# EAGLE schematic Autonomous_v1 (EAGLE 9.7.0)
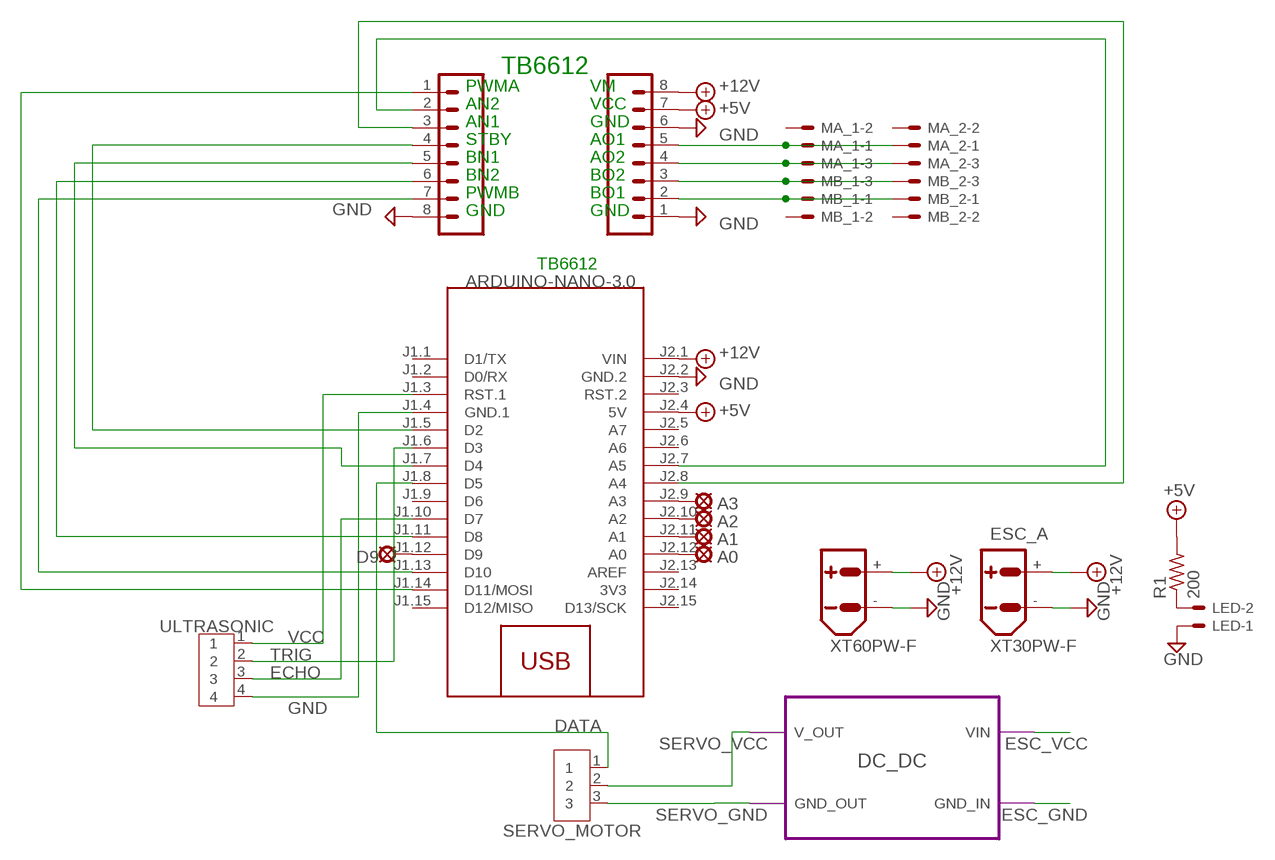
[diagram p0: schematic, sheet 1]

## Parts
A0  LSP10  [LSP10]
A1  LSP10  [LSP10]
A2  LSP10  [LSP10]
A3  LSP10  [LSP10]
BATTERY  XT60PW-F  [XT60PW-F]
D9  LSP10  [LSP10]
ESC_A  XT30PW-F  [XT30PW-F]
J1  CONN_08NO_SILK_FEMALE_PTH  [1X08_NO_SILK]
J2  CONN_08NO_SILK_FEMALE_PTH  [1X08_NO_SILK]
LED  JST-XH-02-PIN-LONG-PAD  [JST-XH-02-PACKAGE-LONG-PAD]
M1  ARDUINO-NANO-3.0  [ARDUINO-NANO-3.0]
MA_1  JST-XH-03-PIN-LONG-PAD  [JST-XH-03-PACKAGE-LONG-PAD]
MA_2  JST-XH-03-PIN-LONG-PAD  [JST-XH-03-PACKAGE-LONG-PAD]
MB_1  JST-XH-03-PIN-LONG-PAD  [JST-XH-03-PACKAGE-LONG-PAD]
MB_2  JST-XH-03-PIN-LONG-PAD  [JST-XH-03-PACKAGE-LONG-PAD]
R1  200  R-US_0204/5  [0204/5]
SERVO_MOTOR  B3P-VH  [B3P-VH_396_3N]
ULTRASONIC  B4B-XH-A  [B4B-XH-A]

## Module instances
DC_DC = DC_DC

## Nets
+5V: J1.7 M1.J2.4(5V) R1.2
+12V: BATTERY.+ ESC_A.+ J1.8 M1.J2.1(VIN)
DATA: M1.J1.8(D5) SERVO_MOTOR.1
ECHO: M1.J1.10(D7) ULTRASONIC.3
ESC_GND: port DC_DC.GND_IN
ESC_VCC: port DC_DC.VIN
GND: BATTERY.- ESC_A.- J1.1 J1.6 J2.8 LED.1 M1.J1.4(GND.1) M1.J2.2(GND.2) ULTRASONIC.4
N$3: D9.MP M1.J1.12(D9)
N$8: J2.4 M1.J1.5(D2)
N$9: J2.3 M1.J2.8(A4)
N$10: J1.5 MA_1.1 MA_2.1
N$11: J1.4 MA_1.3 MA_2.3
N$12: J1.2 MB_1.1 MB_2.1
N$13: J1.3 MB_1.3 MB_2.3
N$15: J2.2 M1.J2.7(A5)
N$16: J2.5 M1.J1.7(D4)
N$17: J2.6 M1.J1.11(D8)
N$18: LED.2 R1.1
N$20: J2.7 M1.J1.13(D10)
N$21: J2.1 M1.J1.14(D11/MOSI)
N$24: A3.MP M1.J2.9(A3)
N$25: A1.MP M1.J2.11(A1)
N$27: A0.MP M1.J2.12(A0)
N$28: A2.MP M1.J2.10(A2)
SERVO_GND: SERVO_MOTOR.3 ; port DC_DC.GND_OUT
SERVO_VCC: SERVO_MOTOR.2 ; port DC_DC.V_OUT
TRIG: M1.J1.6(D3) ULTRASONIC.2
VCC: M1.J1.3(RST.1) ULTRASONIC.1
Unconnected: M1.J1.1(D1/TX) M1.J1.2(D0/RX) M1.J1.9(D6) M1.J1.15(D12/MISO) M1.J2.3(RST.2) M1.J2.5(A7) M1.J2.6(A6) M1.J2.13(AREF) M1.J2.15(D13/SCK) MA_1.2 MA_2.2 MB_1.2 MB_2.2

## Notes on the sheet
- TB6612
- PWMA | VM
- AN2 | VCC
- AN1 | GND
- STBY | AO1
- BN1 | AO2
- BN2 | BO2
- PWMB | BO1
- GND | GND
- TB6612

## Power pins joined to a net without a drawn wire
3V3: M1.J2.14(3V3)

## Library data of the parts
A0 A1-A3 D9 = solpad:LSP10: SOLDER PAD drill 1.0 mm, distributor Buerklin, 12H555
BATTERY = xt30:XT60: AMASS XT60 connector Store in Japan AMASS XT60 connector <https://szc.jp/ams-xt60>
ESC_A = xt30:XT30: AMASS XT30 connector Store in Japan AMASS XT30 connector <https://szc.jp/ams-xt30>
J1 J2 = SparkFun-Connectors:CONN_08: Multi connection point. Often used as Generic Header-pin footprint for 0.1 inch spaced/style header connections On any of the 0.1 inch spaced packages, you can populate with these: Break Away Headers - Straight <https://www.sparkfun.com/products/116> (PRT-00116) Break Away Male Headers - Right Angle <https://www.sparkfun.com/products/553> (PRT-00553) Female Headers <https://www.sparkfun.com/products/115> (PRT-00115) Break Away Headers - Machine Pin <https://www.sparkfun.com/products/117> (PRT-00117) Break Away Female Headers - Swiss Machine Pin <https://www.sparkfun.com/products/743> (PRT-00743) Arduino Stackable Header - 8 Pin <https://www.sparkfun.com/products/9279> (PRT-09279) For SCREWTERMINALS and SPRING TERMINALS visit here: Screw Terimnals on SparkFun.com <https://www.sparkfun.com/search/results?term=Screw+Terminals> (5mm/3.5mm/2.54mm spacing) This device is also useful as a general connection point to wire up your design to another part of your project. Our various solder wires solder well into these plated through hole pads. Hook-Up Wire - Assortment (Stranded, 22 AWG) <https://www.sparkfun.com/products/11375> (PRT-11375) Hook-Up Wire - Assortment (Solid Core, 22 AWG) <https://www.sparkfun.com/products/11367> (PRT-11367) View the entire wire category on our website here <https://www.sparkfun.com/categories/141> Special notes: Molex polarized connector foot print use with SKU : PRT-08231 with associated crimp pins and housings. 1MM SMD Version SKU: PRT-10208 NOTES ON THE VARIANTS LOCK and LOCK_LONGPADS... This footprint was designed to help hold the alignment of a through-hole component (i.e. 6-pin header) while soldering it into place. You may notice that each hole has been shifted either up or down by 0.005 of an inch from it's more standard position (which is a perfectly straight line). This slight alteration caused the pins (the squares in the middle) to touch the edges of the holes. Because they are alternating, it causes a "brace" to hold the component in place. 0.005 has proven to be the perfect amount of "off-center" position when using our standard breakaway headers. Although looks a little odd when you look at the bare footprint, once you have a header in there, the alteration is very hard to notice. Also,if you push a header all the way into place, it is covered up entirely on the bottom side.; PROD_ID: CONN-08438
LED = Rembrandt Electronics - JST XH Connectors v1-0:JST-XH-02-PIN: JST XH Connector 2 Pin Wire to board connector. Pitch: 2,54 mm, (0.100") Number of pins: 2 Created by Rembrandt Electronics www.rembrandtelectronics.com
M1 = diy-modules:ARDUINO-NANO-3.0: Arduino Nano 3.0 and compatible devices More details available here: https://www.arduino.cc/en/Main/ArduinoBoardNano Click here to find device on ebay.com <http://www.ebay.com/sch/arduino+nano>
MA_1 MA_2 MB_1 MB_2 = Rembrandt Electronics - JST XH Connectors v1-0:JST-XH-03-PIN: JST XH Connector 2 Pin Wire to board connector. Pitch: 2,54 mm, (0.100") Number of pins: 3 Created by Rembrandt Electronics www.rembrandtelectronics.com
R1 = BeagleBone_Black_Wireless:R-US_: RESISTOR, American symbol
SERVO_MOTOR = Connector:B3P-VH: VH Connector Top Entry - POS, 3POS 7.92MM Details see: Datasheet <http://www.jst-mfg.com/product/pdf/eng/eVH.pdf>; CATEGORY: Header; DESCRIPTION: Connector Header Through Hole 3 position 0.156" (3.96mm); MANUFACTURER: JST Sales America Inc.; MPN: B3P-VH; OPERATING_TEMPERATURE: -25°C ~ 85°C; PART_STATUS: Active; PITCH: 0.156" (3.96mm); ROHS_COMPLIANCE: RoHS non-compliant; SERIES: VH; SUBCATEGORY: Rectangular Connectors; TYPE: Header, Male Pin, Board to Cable/Wire, Through Hole
ULTRASONIC = Connector:B4B-XH-A: XH Connector Top Entry - 4POS Details see: Datasheet <http://www.jst-mfg.com/product/pdf/eng/eXH.pdf>; CATEGORY: Header; DSECRIPTION: Connector Header Through Hole 4 position 0.098" (2.50mm); MANUFACTURER: JST Sales America Inc.; MPN: B4B-XH-A(LF)(SN); OPERATING_TEMPERATURE: -25 C to 85 C; PART_STATUS: ACTIVE; PITCH: 0.098" (2.50mm); ROHS_COMPLIANCE: ROHS3 Compliant; SERIES: XH; SUB_CATEGORY: Rectangular Connectors; TYPE: Header, Male Pin, Board to Cable/Wire, Through Hole

## Module DC_DC
Ports: VIN(io) GND_IN(io) V_OUT(io) GND_OUT(io)

### Library data of the parts